# Altium schematic sheet USB.SchDoc
size A; SheetNumber: 7; SheetTotal: 7
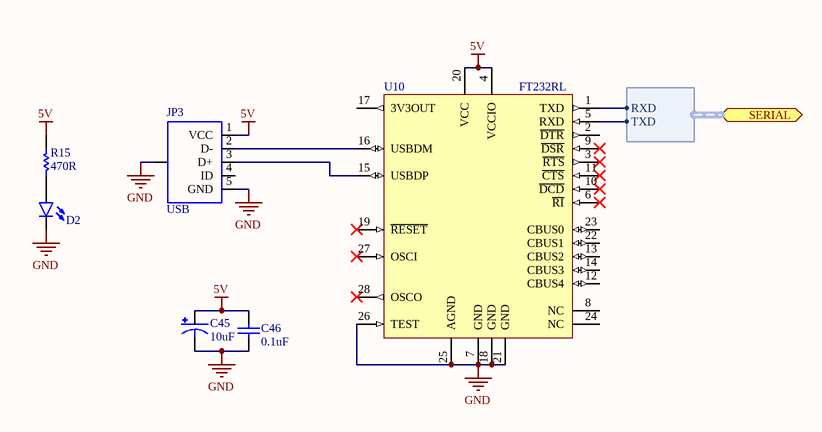
[diagram p0: USB.SchDoc]

## Parts
C45  10uF  [CPOL-RADIAL]
C46  0.1uF  [CAP-PTH]
D2  LED  [LED5MM]  (value not drawn)
JP3  USB  [USB-MICROB]
R15  470R  [RESISTOR]
U10  FT232RL  [SSOP-28_N]

## Ports
SERIAL (harness UART)

## Harnesses
UART: RXD, TXD

## Nets
5V: C45.1(+) C46.1 JP3.1(VCC) R15.1 U10.4(VCCIO) U10.20(VCC)
GND: C45.2(-) C46.2 D2.K JP3.5(GND) JP3.6(SHIELD) U10.7(GND) U10.18(GND) U10.21(GND) U10.25(AGND) U10.26(TEST)
NetD2_A: D2.A R15.2
NetJP3_2: JP3.2(D-) U10.16(USBDM)
NetJP3_3: JP3.3(D+) U10.15(USBDP)
NetU10_1: U10.1(TXD) ; port SERIAL.RXD
NetU10_5: U10.5(RXD) ; port SERIAL.TXD

Not connected (* = marked no-connect by the designer): JP3 4(ID); U10 2(~{DTR}) 3(~{RTS})* 6(~{RI})* 8(NC) 9(~{DSR})* 10(~{DCD})* 11(~{CTS})* 12(CBUS4) 13(CBUS2) 14(CBUS3) 17(3V3OUT) 19(~{RESET})* 22(CBUS1) 23(CBUS0) 24(NC) 27(OSCI)* 28(OSCO)*

## Library data of the parts
C45 = PolarizedCap
C46 = Cap
D2 = LED: PartNumber: LTST-C193TGKT-5A; Manufacturer: Lite-On Inc.; PackageReference: 0603; PackageDescription: 0603 (1608 Metric); Mounting Technology: Surface Mount
JP3 = USB_MICROB_SMT: pin to pad: 1>VBUS 2>D- 3>D+ 4>ID 5>GND 6>MT1+P$1+P$2+MT2; PartNumber: 10118192-0001LF; Manufacturer: Amphenol FCI; Mounting Technology: Surface Mount; PackageReference: USB - Micro B
R15 = Resistor
U10 = CMP-0078-00028-3: USB UART Asynchronous Serial Data Transfer Chip, 28-pin SSOP, Tube; PartNumber: FT232RL-Tube; Manufacturer: FTDI; ComponentLink1Description: Manufacturer URL; ComponentLink2URL: http://www.ftdichip.com/Support/Documents/DataSheets/ICs/DS_FT232R.pdf; PackageVersion: Mar-12; RevisionNote: DatasheetVersion updated to 2.10 Mar-2012; PackageDescription: 28-Pin Small Outline Package 0.65 mm Pitch; PackageReference: SSOP-28; DatasheetVersion: ver 2.10, Mar-2012; ComponentLink2Description: Datasheet; ComponentLink1URL: http://www.ftdichip.com/